# Altium schematic sheet BuckConverter.SchDoc
size A; SheetNumber: 2; SheetTotal: 2
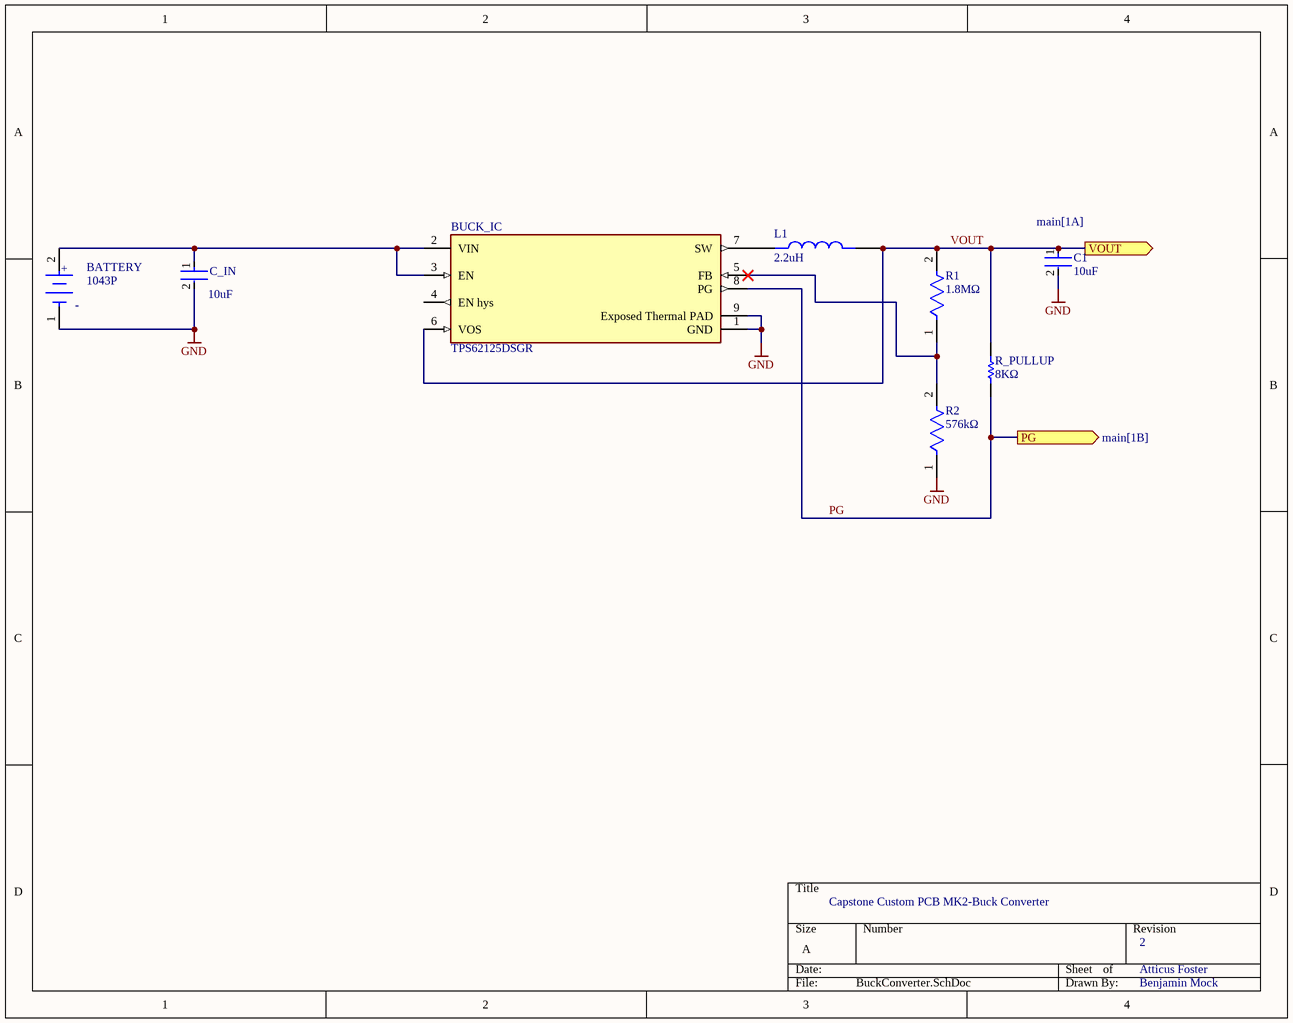
[diagram p0: BuckConverter.SchDoc]

## Parts
BATTERY  1043P  [FP-1043P-MFG]
BUCK_IC  TPS62125DSGR  [FP-DSG0008A-MFG]
C1  10uF  [FP-GRM21B-0_15-IPC_C]
C_IN  10uF  [FP-GRM21B-0_15-IPC_C]
L1  2.2uH  [IND_LPS3314-222MRB]
R1  1.8MΩ  [FP-MCR10-MFG]
R2  576kΩ  [FP-TFCR0603-IPC_A]
R_PULLUP  8KΩ  [RESC0402(1005)_M]

## Ports
PG (out, see main[1B]), VOUT (out, see main[1A])

## Nets
GND: BATTERY.1(C) BUCK_IC.1(GND) BUCK_IC.9(Exposed_Thermal_PAD) C1.2 C_IN.2 R2.1
PG: BUCK_IC.8(PG) R_PULLUP.1 ; port PG
VOUT: BUCK_IC.6(VOS) C1.1 L1.2 R1.2 R_PULLUP.2 ; port VOUT
NetBATTERY_2: BATTERY.2(A) BUCK_IC.2(VIN) BUCK_IC.3(EN) C_IN.1
NetBUCK_IC_5: BUCK_IC.5(FB) R1.1 R2.2
NetBUCK_IC_7: BUCK_IC.7(SW) L1.1

Not connected (* = marked no-connect by the designer): BUCK_IC 4(EN_hys)

## Notes on the sheet
- Capstone Custom PCB MK2-Buck Converter
- Atticus Foster
- 2
- Benjamin Mock
- (in symbol CMP-19636-000034-1) +

## Library data of the parts
BATTERY = CMP-19636-000034-1: BATT HOLDER 18650 1 CELL PC PIN; Number of Cells: 1; Series: -; Termination: PC Pin; Package Quantity: 50; Min Operating Temperature: -50°C; Mount: Through Hole; Packaging: Tray; Max Operating Temperature: 145°C
BUCK_IC = CMP-04918-000040-2: IC REG BUCK ADJ 300MA 8WSON; Min Output Voltage: 1.2V; Min Input Voltage: 3V; Quiescent Current: 13uA; Number of Outputs: 1; Output Voltage: 10V; Output Configuration: Positive; Synchronous Rectifier: Yes; Output Type: Adjustable; Max Input Voltage: 17V; Switching Frequency: 1MHz; Number of Pins: 8; Max Operating Temperature: 85°C; Output Current: 300mA; Package Quantity: 3000; Radiation Hardening: No; Lead Free: Lead Free; Contact Plating: Gold; Max Output Current: 300mA; Max Output Voltage: 10V; Mount: Surface Mount; Min Operating Temperature: -40°C; Packaging: Tape and Reel
C1 C_IN = CMP-06035-045114-1: Chip Multilayer Ceramic Capacitors for General Purpose, 0805, 10uF, X5R, 15%, 20%, 25V
L1 = LPS3314-222MRB: Inductor, Shld, 2.2uh, 20%, 1.2a, Smd; MF: Coilcraft; SnapEDA_Link: https://www.snapeda.com/parts/LPS3314-222MRB/Coilcraft/view-part/?ref=snap; Package: None; Value: *; MP: LPS3314-222MRB; Check_prices: https://www.snapeda.com/parts/LPS3314-222MRB/Coilcraft/view-part/?ref=eda
R1 = CMP-08839-014638-1: Thick Film Chip Resistor, 0805, 1.8MΩ, 1%, 100ppm/°C, 0.125W, 150V; Power Rating: 125mW; Resistance: 1.8MR; Features: Automotive AEC-Q200; Packaging: Tape and Reel; Resistor Type: Thick Film; Series: MCR10; RoHS Compliant: Yes; Case Code (Imperial): 0805; Number of Terminations: 2; Length: 0.079inch; Package Quantity: 1; Voltage Rating (DC): 150V; Case Code (Metric): 2012; Case/Package: 0805; Mount: Surface Mount; Size Code: 0805; Max Power Dissipation: 125mW; Height: 0.024inch; Tolerance: 1%; Temperature Coefficient: 100ppm/°C; Lead Free: Lead Free; Min Operating Temperature: -55°C; Max Operating Temperature: 155°C; Width: 0.049inch
R2 = CMP-250906-142061-1: RES Thin Film,  576kΩ, 0.1%, 0.1W, 25ppm/°C, 0603
R_PULLUP = CMP-1011-00096-1: 8K2 0.063W 5% 0402 (1005 Metric)  SMD; Case-EIA: 0402; Case-Metric: 1005; Value: 8200.00 Ohm; Technology: SMT; Power: 0.063 W; Tolerance: 5 %